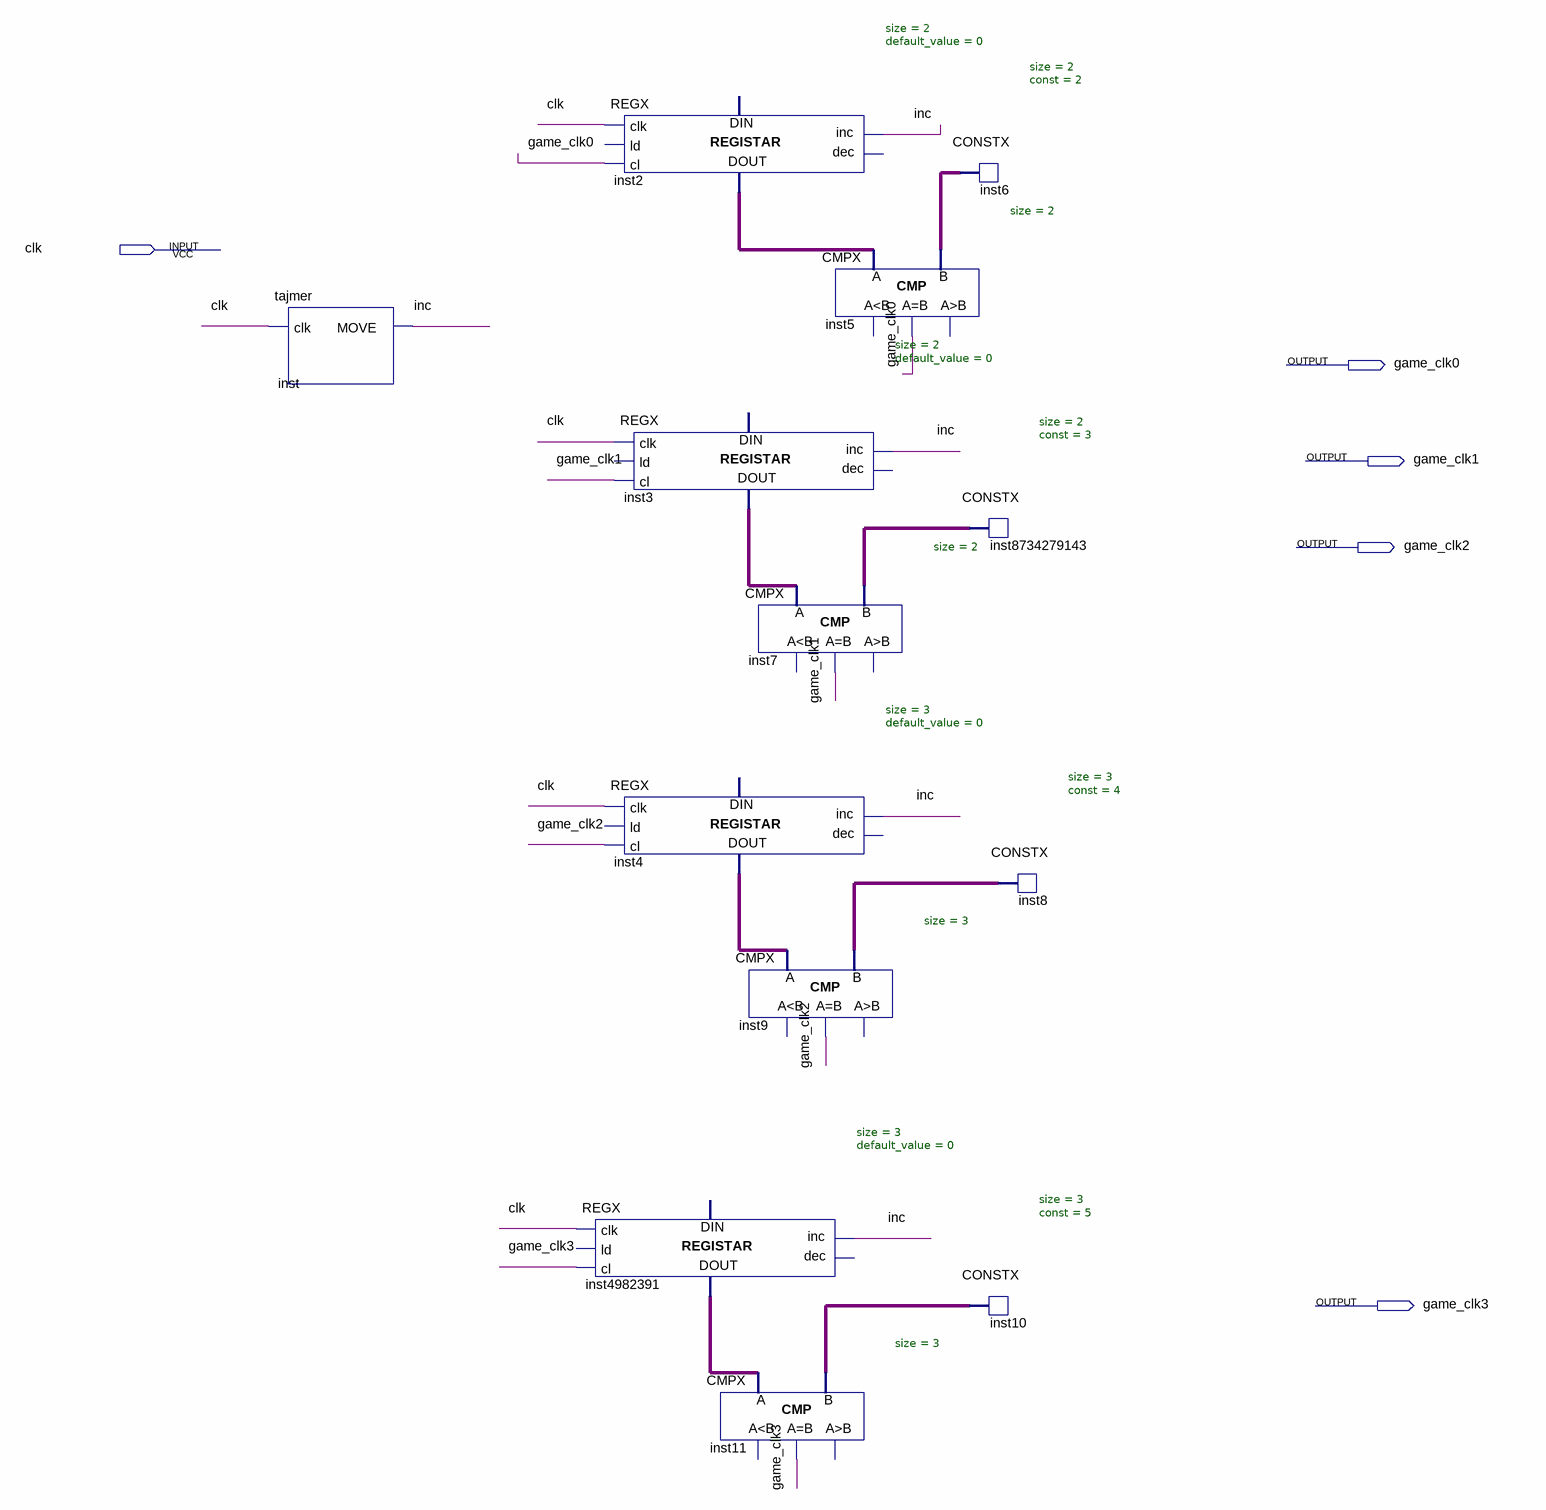
[diagram p0: schematic sheet]
// Quartus schematic game_speed.bdf as structural Verilog: 13 symbols, 5 pins
module game_speed (
  input  clk,
  output game_clk0,
  output game_clk1,
  output game_clk2,
  output game_clk3
);

  wire inc;
  wire [1:0] inst2_data_out, inst3_data_out, inst6_data, inst8734279143_data;
  wire [2:0] inst4_data_out, inst8_data, inst10_data, inst4982391_data_out;

  tajmer inst (.clk(clk), .MOVE(inc));
  REGX #(.size(2), .default_value(0)) inst2 (
    .clk(clk), .cl(game_clk0), .inc(inc), .data_out(inst2_data_out));  // open: ld, dec, data_in
  REGX #(.size(2), .default_value(0)) inst3 (
    .clk(clk), .cl(game_clk1), .inc(inc), .data_out(inst3_data_out));  // open: ld, dec, data_in
  REGX #(.size(3), .default_value(0)) inst4 (
    .clk(clk), .cl(game_clk2), .inc(inc), .data_out(inst4_data_out));  // open: ld, dec, data_in
  REGX #(.size(3), .default_value(0)) inst4982391 (
    .clk(clk), .cl(game_clk3), .inc(inc), .data_out(inst4982391_data_out));  // open: ld, dec, data_in
  CMPX #(.size(3)) inst11 (.A(inst4982391_data_out), .B(inst10_data), .eq(game_clk3));  // open: ls, gr
  CMPX #(.size(2)) inst7 (.A(inst3_data_out), .B(inst8734279143_data), .eq(game_clk1));  // open: ls, gr
  CMPX #(.size(3)) inst9 (.A(inst4_data_out), .B(inst8_data), .eq(game_clk2));  // open: ls, gr
  CMPX #(.size(2)) inst5 (.A(inst2_data_out), .B(inst6_data), .eq(game_clk0));  // open: ls, gr
  CONSTX #(.size(2), .\const (2)) inst6 (.data(inst6_data));
  CONSTX #(.size(2), .\const (3)) inst8734279143 (.data(inst8734279143_data));
  CONSTX #(.size(3), .\const (4)) inst8 (.data(inst8_data));
  CONSTX #(.size(3), .\const (5)) inst10 (.data(inst10_data));
endmodule
